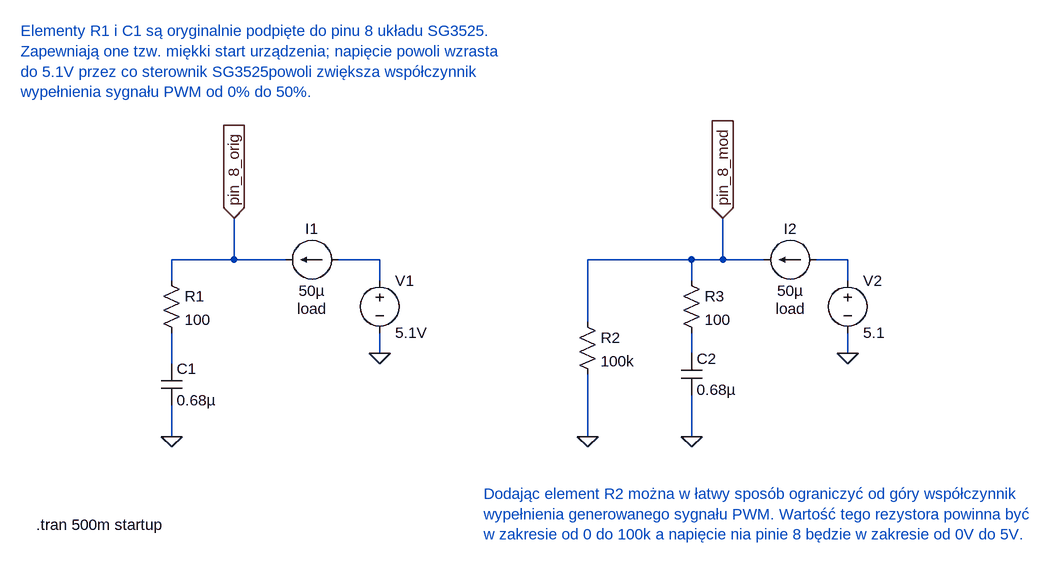
[diagram p0: schematic pin8_test.asc]
pin8_test.asc, the LTspice schematic file:
Version 4
SHEET 1 1516 680
WIRE -464 64 -464 0
WIRE -464 64 -560 64
WIRE -384 64 -464 64
WIRE -240 64 -304 64
WIRE 240 64 80 64
WIRE 288 64 288 0
WIRE 288 64 240 64
WIRE 352 64 288 64
WIRE 480 64 432 64
WIRE -560 96 -560 64
WIRE -240 96 -240 64
WIRE 240 96 240 64
WIRE 480 96 480 64
WIRE 80 160 80 64
WIRE -240 208 -240 176
WIRE 240 208 240 176
WIRE 480 208 480 176
WIRE -560 224 -560 176
WIRE -560 336 -560 288
WIRE 80 336 80 240
WIRE 240 336 240 272
FLAG -240 208 0
FLAG -560 336 0
FLAG 80 336 0
FLAG -464 0 pin_8_orig
IOPIN -464 0 In
FLAG 480 208 0
FLAG 240 336 0
FLAG 288 0 pin_8_mod
IOPIN 288 0 In
SYMBOL voltage -240 80 R0
WINDOW 123 0 0 Left 0
WINDOW 39 0 0 Left 0
SYMATTR InstName V1
SYMATTR Value 5.1V
SYMBOL current -304 64 R90
WINDOW 0 -32 40 VBottom 2
WINDOW 3 32 40 VTop 2
WINDOW 123 0 0 Left 0
WINDOW 39 60 40 VTop 2
SYMATTR InstName I1
SYMATTR Value 50µ
SYMATTR SpiceLine load
SYMBOL res -576 80 R0
SYMATTR InstName R1
SYMATTR Value 100
SYMBOL cap -576 224 R0
SYMATTR InstName C1
SYMATTR Value 0.68µ
SYMBOL res 64 144 R0
SYMATTR InstName R2
SYMATTR Value 100k
SYMBOL current 432 64 R90
WINDOW 0 -32 40 VBottom 2
WINDOW 3 32 40 VTop 2
WINDOW 123 0 0 Left 0
WINDOW 39 60 40 VTop 2
SYMATTR InstName I2
SYMATTR Value 50µ
SYMATTR SpiceLine load
SYMBOL voltage 480 80 R0
WINDOW 123 0 0 Left 0
WINDOW 39 0 0 Left 0
SYMATTR InstName V2
SYMATTR Value 5.1
SYMBOL res 224 80 R0
SYMATTR InstName R3
SYMATTR Value 100
SYMBOL cap 224 208 R0
SYMATTR InstName C2
SYMATTR Value 0.68µ
TEXT -768 472 Left 2 !.tran 500m startup
TEXT -792 -288 Left 2 ;Elementy R1 i C1 są oryginalnie podpięte do pinu 8 układu SG3525. \nZapewniają one tzw. miękki start urządzenia; napięcie powoli wzrasta\ndo 5.1V przez co sterownik SG3525powoli zwiększa współczynnik\nwypełnienia sygnału PWM od 0% do 50%.
TEXT -80 424 Left 2 ;Dodając element R2 można w łatwy sposób ograniczyć od góry współczynnik\nwypełnienia generowanego sygnału PWM. Wartość tego rezystora powinna być\nw zakresie od 0 do 100k a napięcie nia pinie 8 będzie w zakresie od 0V do 5V.

The netlist it stands for:
* pin8_test.asc
V1 N001 0 5.1V
I1 N001 pin_8_orig 50µ load
R1 pin_8_orig N004 100
C1 N004 0 0.68µ
R2 pin_8_mod 0 100k
I2 N002 pin_8_mod 50µ load
V2 N002 0 5.1
R3 pin_8_mod N003 100
C2 N003 0 0.68µ
.tran 500m startup
* Elementy R1 i C1 są oryginalnie podpięte do pinu 8 układu SG3525.
* Zapewniają one tzw. miękki start urządzenia; napięcie powoli wzrasta
* do 5.1V przez co sterownik SG3525powoli zwiększa współczynnik
* wypełnienia sygnału PWM od 0% do 50%.
* Dodając element R2 można w łatwy sposób ograniczyć od góry współczynnik
* wypełnienia generowanego sygnału PWM. Wartość tego rezystora powinna być
* w zakresie od 0 do 100k a napięcie nia pinie 8 będzie w zakresie od 0V do 5V.
.backanno
.end